# EAGLE design at89s52-mc-V0 (EAGLE 5.07)
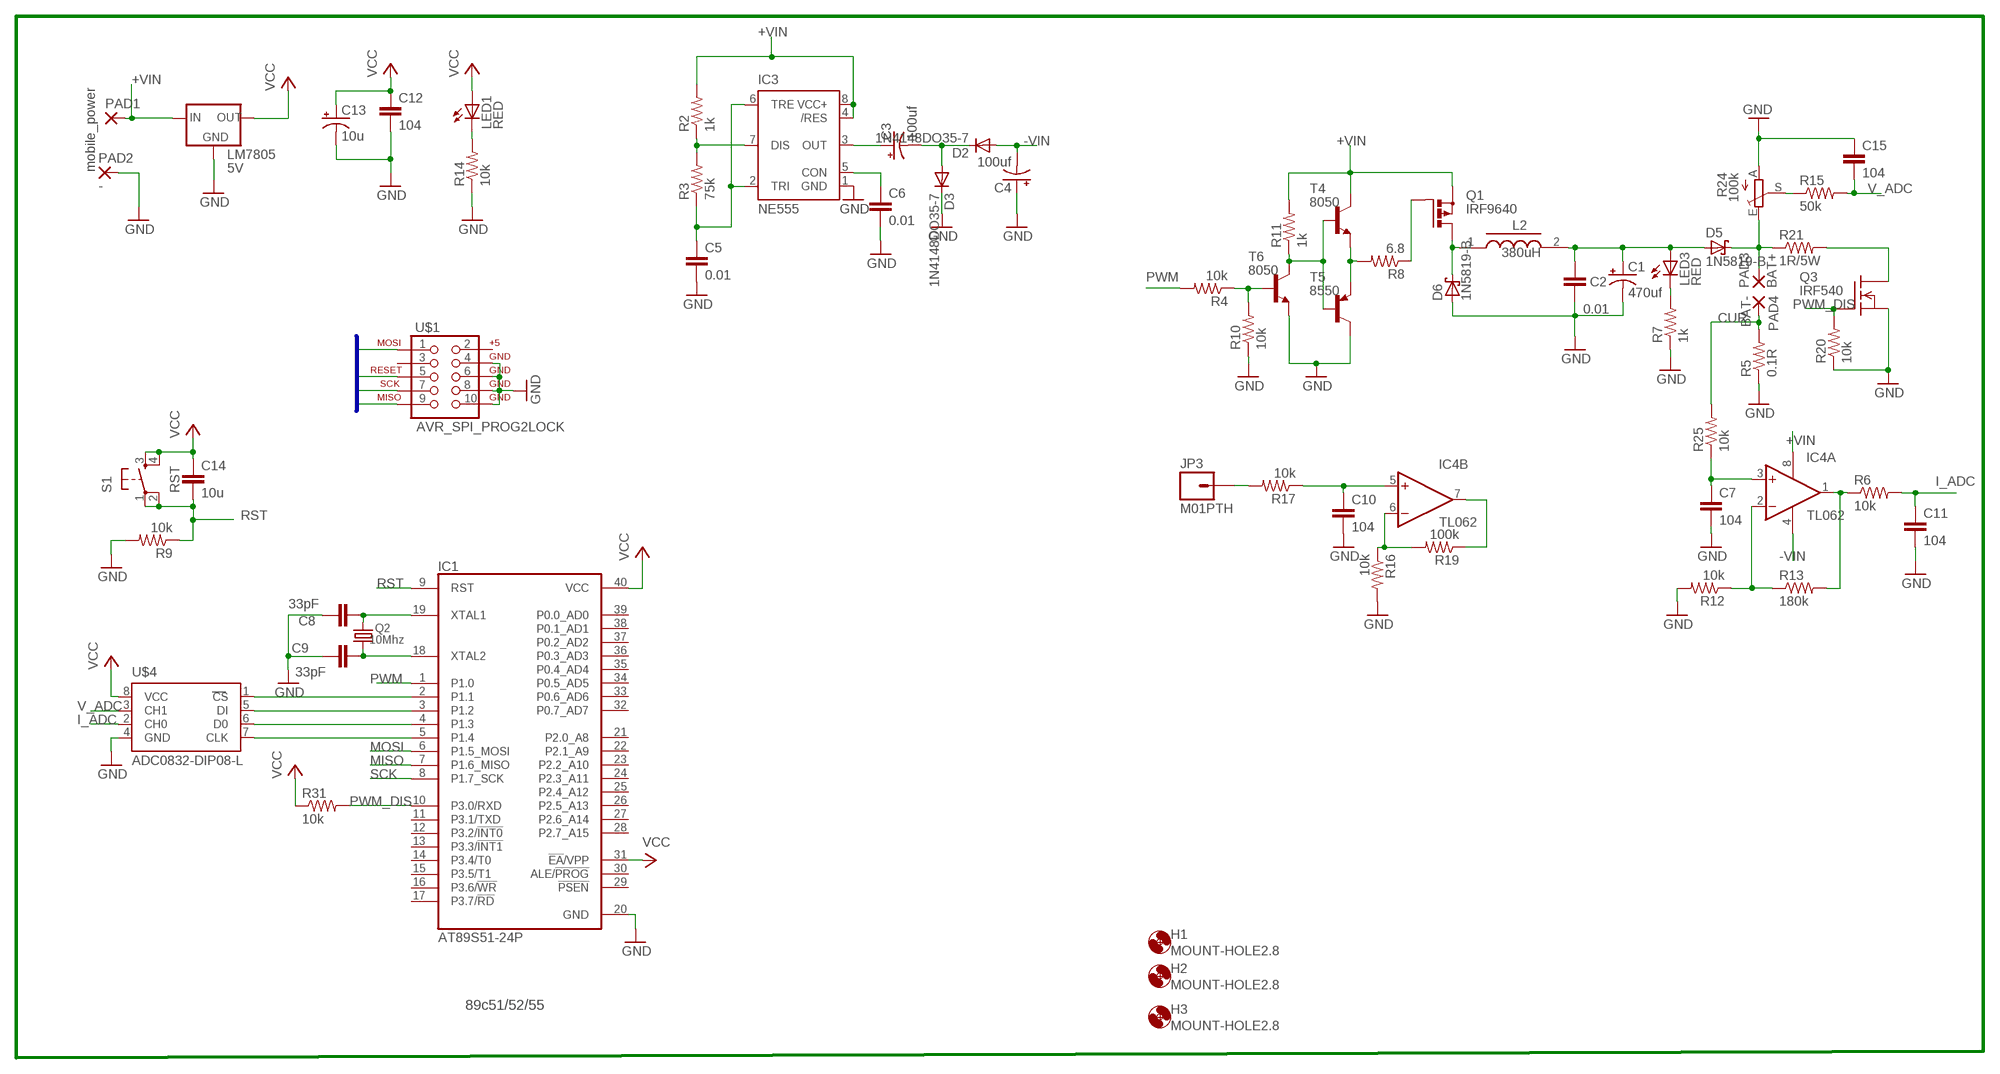
[diagram p0: schematic, sheet 1]

## Parts
C1  470uf  CAP_POLPTH1  [CPOL-RADIAL-100UF-25V]
C2  0.01  CAP0805  [0805]
C3  100uf  CAP_POLPTH1  [CPOL-RADIAL-100UF-25V]
C4  100uf  CAP_POLPTH1  [CPOL-RADIAL-100UF-25V]
C5  0.01  CAP0805  [0805]
C6  0.01  CAP0805  [0805]
C7  104  CAP0805  [0805]
C8  33pF  CAPPTH1  [CAP-PTH-5MM]
C9  33pF  CAPPTH1  [CAP-PTH-5MM]
C10  104  CAP0805  [0805]
C11  104  CAP0805  [0805]
C12  104  CAP0805  [0805]
C13  10u  CAP_POL7343  [EIA7343]
C14  10u  CAP0805  [0805]
C15  104  CAP0805  [0805]
D2  1N4148DO35-7  DIODEIN4148-SMD  [DIODE-IN4148-SMD]
D3  1N4148DO35-7  DIODEIN4148-SMD  [DIODE-IN4148-SMD]
D5  1N5819-B  [DO41-7.6]
D6  1N5819-B  [DO41-7.6]
H1  MOUNT-HOLE2.8  [2,8]
H2  MOUNT-HOLE2.8  [2,8]
H3  MOUNT-HOLE2.8  [2,8]
IC1  AT89S51-24P  [DIL40]
IC3  NE555  [DIL-08]
IC4  TL062  [DIP08-L]
JP3  M01PTH  [1X01]
L2  380uH  INDUCTOR-IED16  [ED16]
LED1  RED  LED3MM  [LED3MM]
LED3  RED  LED3MM  [LED3MM]
LM7805  5V  LM1117TO252  [TO252]
PAD1  mobile_power  WIREPADSMD5-2,5  [5-2,5]
PAD2  -  WIREPADSMD5-2,5  [5-2,5]
PAD3  BAT+  2,54/1,1  [2,54/1,1]
PAD4  BAT-  2,54/1,1  [2,54/1,1]
Q1  IRF9640  PMOSFET_PTO220BH  [TO220BH]
Q2  10Mhz  HC18U-V  [HC18U-V]
Q3  IRF540  [TO220]
R2  1k  RESISTOR  [0805]
R3  75k  RESISTOR  [0805]
R4  10k  RESISTORPTH1  [AXIAL-0.3]
R5  0.1R  RESISTOR0414/15  [0414/15]
R6  10k  RESISTOR  [0805]
R7  1k  RESISTOR  [0805]
R8  6.8  RESISTORPTH1  [AXIAL-0.3]
R9  10k  RESISTOR0805  [0805]
R10  10k  RESISTORPTH1  [AXIAL-0.3]
R11  1k  RESISTORPTH1  [AXIAL-0.3]
R12  10k  RESISTOR  [0805]
R13  180k  RESISTOR  [0805]
R14  10k  RESISTOR0805  [0805]
R15  50k  RESISTOR  [0805]
R16  10k  RESISTOR  [0805]
R17  10k  RESISTOR  [0805]
R19  100k  RESISTOR  [0805]
R20  10k  RESISTOR  [0805]
R21  1R/5W  RESISTOR0414/15  [0414/15]
R24  100k  TRIM_EU-B64Y  [B64Y]
R25  10k  RESISTOR  [0805]
R31  10k  RESISTOR0805  [0805]
S1  RST  TAC_SWITCHPTH  [TACTILE-PTH]
T4  8050  -NPN-TO92-EBC  [TO92-EBC]
T5  8550  -PNP-TO92-EBC  [TO92-EBC]
T6  8050  -NPN-TO92-EBC  [TO92-EBC]
U$1  AVR_SPI_PROG2LOCK  [2X5-SHROUDED_LOCK]
U$4  ADC0832-DIP08-L  [DIP08-L]

## Nets
+VIN: IC3.4(/RES) IC3.8(VCC+) IC4.8(P:V+) LM7805.2(IN) PAD1.1(P) Q1.S R2.2 R11.P$2 T4.C
-VIN: C4.2(-) D2.A IC4.4(P:V-)
CUR: PAD4.1(P) R5.2 R25.2
GND: C1.2(-) C2.2 C4.1(+) C5.2 C6.2 C7.2 C8.2 C9.2 C10.2 C11.2 C12.2 C13.C(-) C15.1 D3.C D6.A IC1.20(GND) IC3.1(GND) LM7805.1(GND) PAD2.1(P) Q3.3(S) R5.1 R7.1 R9.2 R10.P$1 R12.2 R14.1 R16.2 R20.1 R24.A T5.C T6.E U$1.4 U$1.6 U$1.8 U$1.10 U$4.4(GND)
I_ADC: C11.1 R6.2 U$4.2(CH0)
MISO: IC1.7(P1.6_MISO) U$1.9
MOSI: IC1.6(P1.5_MOSI) U$1.1
N$8: IC3.7(DIS) R2.1 R3.2
N$10: C5.1 IC3.2(TRI) IC3.6(TRE) R3.1
N$11: C6.1 IC3.5(CON)
N$12: C3.1(+) IC3.3(OUT)
N$13: C3.2(-) D2.C D3.A
N$14: C9.1 IC1.18(XTAL2) Q2.1
N$17: LED1.K(C) R14.2
N$20: IC4.7(B:OUT) R19.1
N$21: R4.P$1 R10.P$2 T6.B
N$22: R11.P$1 T4.B T5.B T6.C
N$23: R8.P$2 T4.E T5.E
N$24: LED3.K(C) R7.2
N$25: Q1.G R8.P$1
N$28: C1.1(+) C2.1 D5.A L2.2 LED3.A
N$29: D6.C L2.1 Q1.D
N$30: D5.C PAD3.1(P) R21.1 R24.E
N$31: IC4.2(A:-IN) R12.1 R13.1
N$32: IC4.1(A:OUT) R6.1 R13.2
N$34: C8.1 IC1.19(XTAL1) Q2.2
N$35: IC4.6(B:-IN) R16.1 R19.2
N$36: Q3.2(D) R21.2
N$37: IC1.3(P1.2) U$4.5(DI)
N$38: IC1.4(P1.3) U$4.6(D0)
N$39: IC1.5(P1.4) U$4.7(CLK)
N$52: C10.1 IC4.5(B:+IN) R17.1
N$53: R15.1 R24.S
N$54: C7.1 IC4.3(A:+IN) R25.1
N$56: JP3.1 R17.2
N$57: IC1.2(P1.1) U$4.1(CS)
PWM: IC1.1(P1.0) R4.P$2
PWM_DIS: IC1.10(P3.0/RXD) Q3.1(G) R20.2 R31.2
RST: C14.2 IC1.9(RST) R9.1 S1.1 S1.2 U$1.5
SCK: IC1.8(P1.7_SCK) U$1.7
V_ADC: C15.2 R15.2 U$4.3(CH1)
VCC: C12.1 C13.A(+) C14.1 IC1.31(!EA!/VPP) IC1.40(VCC) LED1.A LM7805.3(OUT) R31.1 S1.3 S1.4 U$4.8(VCC)
Unconnected: IC1.11(P3.1/TXD) IC1.12(P3.2/!INT0) IC1.13(P3.3/!INT1) IC1.14(P3.4/T0) IC1.15(P3.5/T1) IC1.16(P3.6/!WR) IC1.17(P3.7/!RD) IC1.21(P2.0_A8) IC1.22(P2.1_A9) IC1.23(P2.2_A10) IC1.24(P2.3_A11) IC1.25(P2.4_A12) IC1.26(P2.5_A13) IC1.27(P2.6_A14) IC1.28(P2.7_A15) IC1.29(!PSEN) IC1.30(ALE/!PROG) IC1.32(P0.7_AD7) IC1.33(P0.6_AD6) IC1.34(P0.5_AD5) IC1.35(P0.4_AD4) IC1.36(P0.3_AD3) IC1.37(P0.2_AD2) IC1.38(P0.1_AD1) IC1.39(P0.0_AD0) U$1.2 U$1.3

## Buses
B$1

## Notes on the sheet
- 89c51/52/55

## Library data of the parts
C1 C3 C4 C13 = SparkFun:CAP_POL: Capacitor Polarized These are standard SMD and PTH capacitors. Normally 10uF, 47uF, and 100uF in electrolytic and tantalum varieties. Always verify the external diameter of the through hole cap, it varies with capacity, voltage, and manufacturer. The EIA devices should be standard.
C2 C5-C7 C10-C12 C14 C15 = SparkFun:CAP: Capacitor Standard 0603 ceramic capacitor, and 0.1" leaded capacitor.
C8 C9 = digital-toy:CAP: Capacitor Standard 0603 ceramic capacitor, and 0.1" leaded capacitor.
D2 D3 = digital-toy:DIODE: Diode These are standard reverse protection diodes and small signal diodes. SMA package can handle up to about 1A. SOD-323 can handle about 200mA. What the SOD-323 package when ordering, there are some mfgs out there that are 5-pin packages.
D5 D6 = digital-toy:1N581*: 1.0A SCHOTTKY BARRIER RECTIFIER Source: http://www.diodes.com/datasheets/ds23001.pdf
H1-H3 = holes:MOUNT-HOLE: MOUNTING HOLE with drill center marker
IC1 = atmel:AT89S51-*: 8-bit Microcontroller with 4K BytesIn-System Programmable Flash Source: http://www.atmel.com/dyn/resources/prod_documents/doc2487.pdf
IC3 = st-microelectronics:NE555: General purpose bipolar Timer
IC4 = digital-toy:TL062: Linear Devices dual Operational amplifiers, JFET-Input Stage Input offset voltage:typical 3mV(25C)
JP3 = SparkFun:M01: Header 1 Standard 1-pin 0.1" header. Use with straight break away headers (SKU : PRT-00116), right angle break away headers (PRT-00553), swiss pins (PRT-00743), machine pins (PRT-00117), and female headers (PRT-00115).
L2 = digital-toy:INDUCTOR-I: Inductors with Iron
LED1 = LED:LED: LED OSRAM: - CHIPLED LG R971, LG N971, LY N971, LG Q971, LY Q971, LO R971, LY R971 LH N974, LH R974 LS Q976, LO Q976, LY Q976 LO Q996 - Hyper CHIPLED LW Q18S LB Q993, LB Q99A, LB R99A - SideLED LS A670, LO A670, LY A670, LG A670, LP A670 LB A673, LV A673, LT A673, LW A673 LH A674 LY A675 LS A676, LA A676, LO A676, LY A676, LW A676 LS A679, LY A679, LG A679 - Hyper Micro SIDELED® LS Y876, LA Y876, LO Y876, LY Y876 LT Y87S - SmartLED LW L88C, LW L88S LB L89C, LB L89S, LG L890 LS L89K, LO L89K, LY L89K LS L896, LA L896, LO L896, LY L896 - TOPLED LS T670, LO T670, LY T670, LG T670, LP T670 LSG T670, LSP T670, LSY T670, LOP T670, LYG T670 LG T671, LOG T671, LSG T671 LB T673, LV T673, LT T673, LW T673 LH T674 LS T676, LA T676, LO T676, LY T676, LB T676, LH T676, LSB T676, LW T676 LB T67C, LV T67C, LT T67C, LS T67K, LO T67K, LY T67K, LW E67C LS E67B, LA E67B, LO E67B, LY E67B, LB E67C, LV E67C, LT E67C LW T67C LS T679, LY T679, LG T679 LS T770, LO T770, LY T770, LG T770, LP T770 LB T773, LV T773, LT T773, LW T773 LH T774 LS E675, LA E675, LY E675, LS T675 LS T776, LA T776, LO T776, LY T776, LB T776 LHGB T686 LT T68C, LB T68C - Hyper Mini TOPLED® LB M676 - Mini TOPLED Santana® LG M470 LS M47K, LO M47K, LY M47K Source: http://www.osram.convergy.de LUXEON: - LUMILED® LXK2-PW12-R00, LXK2-PW12-S00, LXK2-PW14-U00, LXK2-PW14-V00 LXK2-PM12-R00, LXK2-PM12-S00, LXK2-PM14-U00 LXK2-PE12-Q00, LXK2-PE12-R00, LXK2-PE12-S00, LXK2-PE14-T00, LXK2-PE14-U00 LXK2-PB12-K00, LXK2-PB12-L00, LXK2-PB12-M00, LXK2-PB14-N00, LXK2-PB14-P00, LXK2-PB14-Q00 LXK2-PR12-L00, LXK2-PR12-M00, LXK2-PR14-Q00, LXK2-PR14-R00 LXK2-PD12-Q00, LXK2-PD12-R00, LXK2-PD12-S00 LXK2-PH12-R00, LXK2-PH12-S00 LXK2-PL12-P00, LXK2-PL12-Q00, LXK2-PL12-R00 Source: www.luxeon.com KINGBRIGHT: KA-3528ASYC Source: www.kingbright.com
LED3 = SparkFun:LED: LEDs Standard schematic elements and footprints for 5mm, 3mm, 1206, and 0603 sized LEDs. 5mm - Spark Fun Electronics SKU : COM-00529 (and others)
LM7805 = v-reg-2:LM1117
PAD1 PAD2 = wirepad:WIREPAD: Wire PAD connect wire on PCB
PAD3 PAD4 = wirepad:2,54/1,1: THROUGH-HOLE PAD
Q1 = transistor-power:PMOSFET_P: Power MOSFET P-Channel
Q2 = QUARTZ:HC18U-V
Q3 = transistor-fet:IRF540: N-Channel Enhancement MOSFET (HEXFET); 100V; 28A; 0,077Ohm
R2-R4 R6-R8 R10-R13 R15-R17 R19 R20 R25 = SparkFun:RESISTOR: Resistor Basic schematic elements and footprints for 0603, 1206, and PTH 1/10th watt (small) resistors.
R5 R9 R14 R21 R31 = digital-toy:RESISTOR: Resistor Basic schematic elements and footprints for 0603, 1206, and PTH 1/10th watt (small) resistors.
R24 = pot:TRIM_EU-: POTENTIOMETER
S1 = digital-toy:TAC_SWITCH: Momentary Switch Button commonly used for reset or general input. Spark Fun Electronics SKU : COM-00097
T4 T6 = digital-toy:*-NPN-: NPN Transistror
T5 = digital-toy:*-PNP-: PNP Transistror
U$1 = digital-toy:AVR_SPI_PROG2: AVR ICSP Header This is the standard AVR In Circuit Serial Programming header. Minimal, but includes pin one indicator. Works with standard Olimex programmers. Also look for the 6-pin reduced version. Spark Fun Electronics SKU: PRT-00778
U$4 = digital-toy:ADC0832: National Semiconductor ADC 0832, 2 channel, 8bit.

## Board
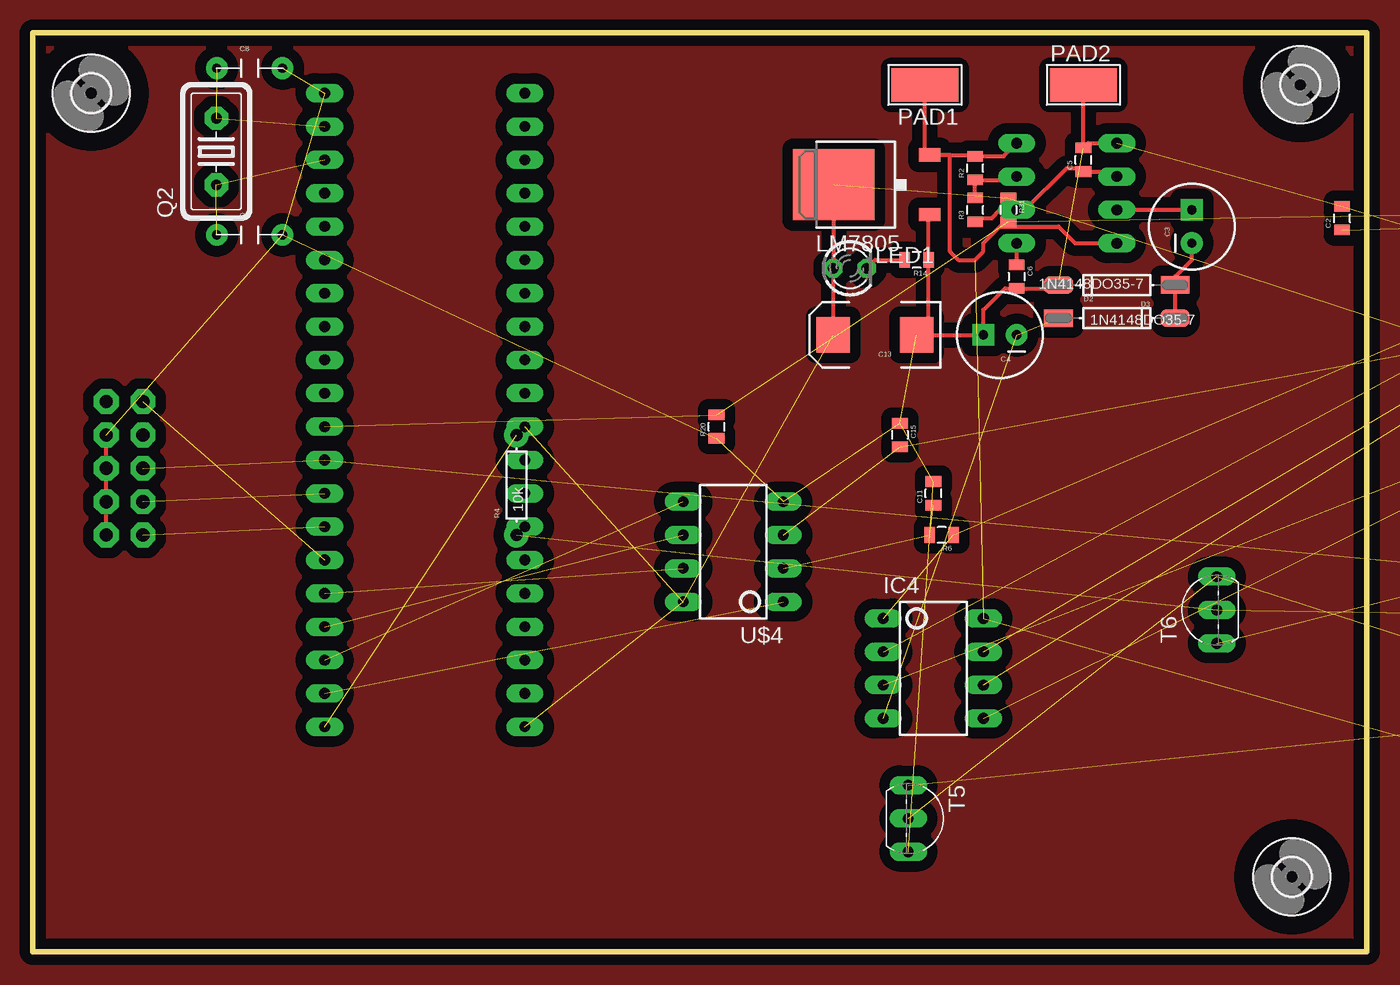
[diagram p1: board, top side]
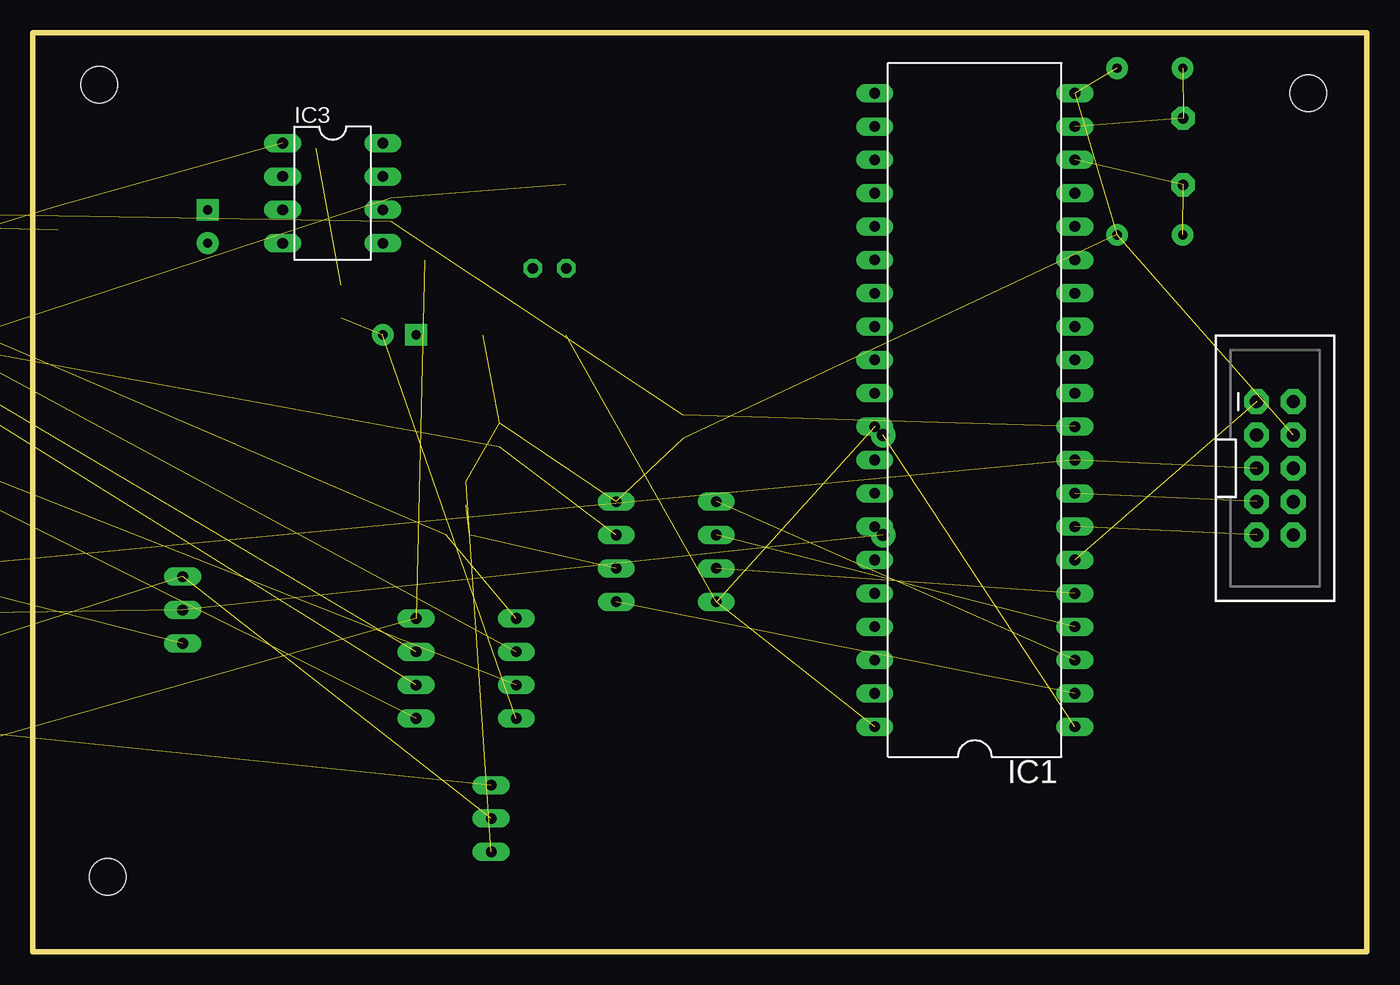
[diagram p2: board, bottom side, seen from below]

Size 101.58 x 70 mm. Coordinates in mm from the lower left corner, seen from the top.
Outline: 0,0 101.58,0 101.58,70 0,70 0,0
Copper layers (1*16): Top 0.035mm / dielectric 1.5mm / Bottom 0.035mm
Design rules "SparkFun": minimum track width 8mil, minimum drill 20mil, track to track 8mil, track to pad 8mil, pad to pad 8mil, via to via 8mil, smd to smd 8mil, copper to edge 10mil, drill to drill 8mil, minimum pad ring 12mil, minimum via ring 10mil, stop-mask expansion 4mil, vias tented up to drill 25mil, thermal gap 10mil

### Footprints (pad centres in the part's own frame; a part is rotated, then mirrored left to right if it is on the bottom)
CPOL-RADIAL-100UF-25V = drill 0.7 pad 1.651 square: 1 1.27,0 | drill 0.7 pad 1.651 round: 2 -1.27,0
0805 = smd 0.8 x 1.2: 1 -0.9,0; 2 0.9,0
CAP-PTH-5MM = drill 0.7 pad 1.651 round: 1 -2.5,0; 2 2.5,0
EIA7343 = smd 2.55 x 2.7: A 3.17,0; C -3.17,0
DIODE-IN4148-SMD = smd 2.184 x 1.321: A -4.445,0; C 4.445,0
DO41-7.6 = drill 1.1 pad 2.032 round: A 3.81,0; C -3.81,0
2,8 = hole 2.8: 0,0
DIL40 = drill 0.813 long: 1 -24.13,-7.62; 2 -21.59,-7.62; 3 -19.05,-7.62; 4 -16.51,-7.62; 5 -13.97,-7.62; 6 -11.43,-7.62; 7 -8.89,-7.62; 8 -6.35,-7.62; 9 -3.81,-7.62; 10 -1.27,-7.62; 11 1.27,-7.62; 12 3.81,-7.62; 13 6.35,-7.62; 14 8.89,-7.62; 15 11.43,-7.62; 16 13.97,-7.62; 17 16.51,-7.62; 18 19.05,-7.62; 19 21.59,-7.62; 20 24.13,-7.62; 21 24.13,7.62; 22 21.59,7.62; 23 19.05,7.62; 24 16.51,7.62; 25 13.97,7.62; 26 11.43,7.62; 27 8.89,7.62; 28 6.35,7.62; 29 3.81,7.62; 30 1.27,7.62; 31 -1.27,7.62; 32 -3.81,7.62; 33 -6.35,7.62; 34 -8.89,7.62; 35 -11.43,7.62; 36 -13.97,7.62; 37 -16.51,7.62; 38 -19.05,7.62; 39 -21.59,7.62; 40 -24.13,7.62
DIL-08 = drill 0.813 long: 1 -3.81,-3.81; 2 -1.27,-3.81; 3 1.27,-3.81; 4 3.81,-3.81; 5 3.81,3.81; 6 1.27,3.81; 7 -1.27,3.81; 8 -3.81,3.81
DIP08-L = drill 0.813 long: 1 0,-2.54; 2 2.54,-2.54; 3 5.08,-2.54; 4 7.62,-2.54; 5 7.62,5.08; 6 5.08,5.08; 7 2.54,5.08; 8 0,5.08
1X01 = drill 1.016 pad 1.88 round: 1 0,0
ED16 = drill 1.016 long: 1 -8.255,0; 2 -3.81,0
LED3MM = drill 0.813 octagon: A -1.27,0; K 1.27,0
LED3MM' = drill 0.813 pad 1.88 round: A -1.27,0; K 1.27,0
TO252 = smd 1 x 1.6: 1 -2.28,-6.07; 2 2.28,-6.07 | smd 5.4 x 6.2: 3 0,1.23
5-2,5 = smd 2.54 x 5.08: 1 0,0
2,54/1,1 = drill 1.118 pad 2.54 octagon: 1 0,0
TO220BH = drill 1.118 long: D 0,-6.35; G -2.54,-6.35; S 2.54,-6.35 | hole 3.302: 0,11.176
HC18U-V = drill 0.813 pad 1.778 octagon: 1 -2.54,0; 2 2.54,0
TO220 = drill 1.118 long: 1 -2.54,-6.35; 2 0,-6.35; 3 2.54,-6.35 | hole 3.302: 0,11.176
AXIAL-0.3 = drill 0.9 pad 1.88 round: P$1 -3.81,0; P$2 3.81,0
0414/15 = drill 1.1 pad 2.54 octagon: 1 -7.62,0 | drill 1.016 pad 2.54 octagon: 2 7.62,0
B64Y = drill 0.813 long: A 2.54,0; E -2.54,0; S 0,0
TACTILE-PTH = drill 1.016 pad 2.032 round: 1 -3.251,2.261; 2 3.251,2.261; 3 -3.251,-2.261; 4 3.251,-2.261
TO92-EBC = drill 0.813 long: B 0,-1.27; C 2.54,-1.27; E -2.54,-1.27
2X5-SHROUDED_LOCK = drill 1.016 pad 1.88 octagon: 1 -1.397,5.08; 2 1.397,5.08; 3 -1.397,2.54; 4 1.397,2.54; 5 -1.397,0; 6 1.397,0; 7 -1.397,-2.54; 8 1.397,-2.54; 9 -1.397,-5.08; 10 1.397,-5.08

### Placement (x,y rotation side)
C1  128.27,75.56 270 top  (outside the outline)
C2  99.69,55.88 90 top
C3  88.27,55.24 90 top
C4  73.66,46.99 180 top
C5  80.01,60.33 90 top
C6  74.93,51.44 270 top
C7  120.02,44.45 0 top  (outside the outline)
C8  16.51,67.31 0 top
C9  16.51,54.61 0 top
C10  123.83,42.55 270 top  (outside the outline)
C11  68.58,34.92 90 top
C12  111.12,33.02 270 top  (outside the outline)
C13  64.14,46.99 180 top
C14  111.76,31.11 270 top  (outside the outline)
C15  66.04,39.37 270 top
D2  82.55,48.26 0 top
D3  82.55,50.8 180 top
D5  123.19,62.87 180 top  (outside the outline)
D6  123.19,39.37 0 top  (outside the outline)
H1  4.45,65.41 0 top
H2  96.52,66.04 0 top
H3  95.89,5.71 0 top
IC1  29.84,41.27 90 bottom
IC3  78.74,57.78 270 bottom
IC4  67.31,25.4 270 top
JP3  125.09,36.83 0 bottom  (outside the outline)
L2  116.2,73.03 270 top  (outside the outline)
LED1  62.23,52.07 0 top
LED3  RED  [LED3MM']  111.12,55.24 0 top  (outside the outline)
LM7805  62.23,58.42 90 top
PAD1  67.94,66.04 90 top
PAD2  80.01,66.04 270 top
PAD3  132.72,33.02 0 top  (outside the outline)
PAD4  135.25,53.34 0 top  (outside the outline)
Q1  118.75,25.4 180 bottom  (outside the outline)
Q2  13.97,60.96 90 top
Q3  163.83,50.8 180 top  (outside the outline)
R2  71.75,59.69 90 top
R3  71.75,56.52 90 top
R4  36.83,35.56 90 top
R5  128.91,62.23 270 top  (outside the outline)
R6  69.22,31.75 180 top
R7  106.05,53.98 270 top  (outside the outline)
R8  128.91,24.13 90 top  (outside the outline)
R9  106.68,28.57 270 top  (outside the outline)
R10  130.18,25.4 0 top  (outside the outline)
R11  106.05,19.68 270 top  (outside the outline)
R12  120.65,52.7 0 top  (outside the outline)
R13  116.84,51.44 180 top  (outside the outline)
R14  67.31,52.7 180 top
R15  123.83,48.9 180 top  (outside the outline)
R16  125.73,39.37 0 bottom  (outside the outline)
R17  140.34,49.53 90 bottom  (outside the outline)
R19  119.38,50.16 0 top  (outside the outline)
R20  52.07,40.01 90 top
R21  137.16,36.83 270 top  (outside the outline)
R24  125.09,31.11 90 bottom  (outside the outline)
R25  118.75,41.91 180 top  (outside the outline)
R31  74.3,56.52 270 top
S1  116.2,46.99 0 bottom  (outside the outline)
T4  111.12,14.61 270 top  (outside the outline)
T5  67.94,10.16 270 top
T6  88.9,26.04 90 top
U$1  6.99,36.83 0 bottom
U$4  54.61,26.67 90 top

### Tracks (layer width: path | path; a pad name or v marks a point on that pad's centre or on a via)
+VIN  (4 unrouted)
  Top 0.305: PAD1.1 67.94,61.05 LM7805.2 69.85,60.7 | 69.85,60.7 71.64,60.7 R2.2 73.92,60.59 IC3.8 | IC3.4 79.38,53.98 78.11,55.24 73.66,55.24 72.39,53.98 72.39,53.34 71.75,52.7 70.48,52.7 69.85,53.34 69.85,60.7
-VIN  (2 unrouted)
CUR  (2 unrouted)
GND  (25 unrouted)
  Top 0.305: U$1.10 U$1.8 U$1.6 U$1.4 | LM7805.1 68.21,56.05 R14.1 68.21,47.9 C13.C C4.1 72.39,48.9 74.03,50.53 C6.2 77.84,50.53 D3.C | PAD2.1 C5.2 80.38,61.59 IC3.1
I_ADC  (2 unrouted)
MISO  (1 unrouted)
MOSI  (1 unrouted)
N$1
  pour Top (isolate 0.813): -19.68,136.53 86.36,136.53 144.78,78.11 144.78,28.57 94.61,-21.59 -33.66,-26.67 -33.02,10.79 -43.18,107.31
N$8
  Top 0.305: IC3.7 74.67,58.79 R2.1 R3.2
N$10
  Top 0.305: IC3.2 82.18,59.42 C5.1 79.75,59.69 78.74,59.69 75.56,56.52 IC3.6 73.66,56.52 73.03,55.88 72.02,55.88 R3.1
N$11
  Top 0.305: C6.1 IC3.5
N$12
  Top 0.305: IC3.3 C3.1
N$13
  Top 0.305: D2.C D3.A 87,51.44 88.27,52.7 C3.2
N$14  (2 unrouted)
N$17
  Top 0.305: R14.2 64.14,52.7 LED1.K
N$20  (1 unrouted)
N$21  (2 unrouted)
N$22  (3 unrouted)
N$23  (2 unrouted)
N$24  (1 unrouted)
N$25  (1 unrouted)
N$28  (4 unrouted)
N$29  (2 unrouted)
N$30  (3 unrouted)
N$31  (2 unrouted)
N$32  (2 unrouted)
N$34  (2 unrouted)
N$35  (2 unrouted)
N$36  (1 unrouted)
N$37  (1 unrouted)
N$38  (1 unrouted)
N$39  (1 unrouted)
N$52  (2 unrouted)
N$53  (1 unrouted)
N$54  (2 unrouted)
N$56  (1 unrouted)
N$57  (1 unrouted)
PWM  (1 unrouted)
PWM_DIS  (3 unrouted)
RST  (5 unrouted)
SCK  (1 unrouted)
V_ADC  (2 unrouted)
VCC  (8 unrouted)
  Top 0.305: LM7805.3 61,52.11 LED1.A C13.A